# EAGLE design LT3060XTS8_45V_to_1V8 (EAGLE 7.2.0)
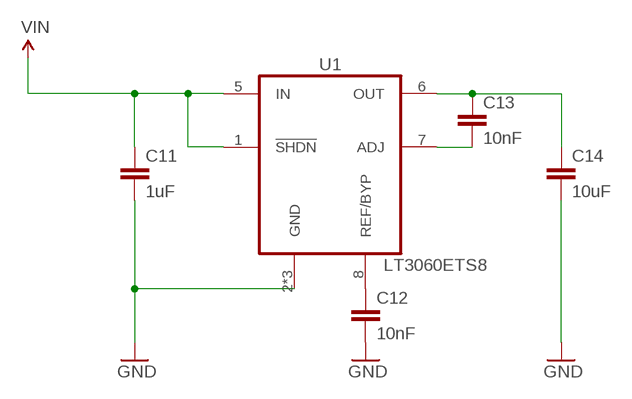
[diagram p0: schematic, sheet 1]

## Parts
C11  1uF  C-EUC0402  [C0402]
C12  10nF  C-EUC0402  [C0402]
C13  10nF  C-EUC0402  [C0402]
C14  10uF  C-EUC0402  [C0402]
U1  LT3060ETS8  [LINEAR_TS8]

## Nets
GND: C11.2 C12.2 C14.2 U1.2(GND) U1.3(GND) U1.4(GND)
N$2: C13.2 U1.7(ADJ)
N$5: C12.1 U1.8(REF/BYP)
OUT: C13.1 C14.1 U1.6(OUT)
VIN: C11.1 U1.1(!SHDN) U1.5(IN)

## Library data of the parts
C11-C14 = rcl:C-EU: CAPACITOR, European symbol
U1 = 1V8:LT3060; TEMP_RANGE: -40 to 125*C

## Board
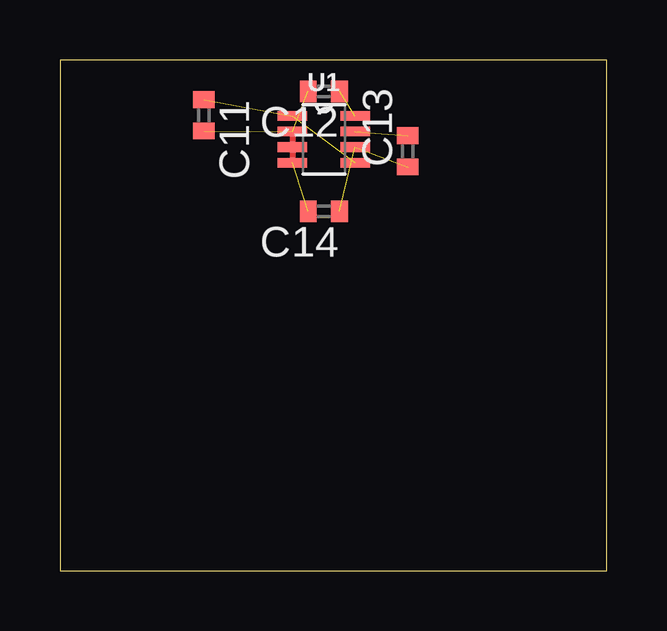
[diagram p1: board, top side]

Size 22.8 x 21.31 mm. Coordinates in mm from the lower left corner, seen from the top.
Outline: 0,0 22.8,0 22.8,21.31 0,21.31 0,0
Copper layers (1*16): Top 0.0356mm / dielectric 1.5011mm / Bottom 0.0356mm
Design rules "oshpark-2layer": minimum track width 6mil, minimum drill 13mil, track to track 6mil, track to pad 6mil, pad to pad 6mil, via to via 6mil, smd to smd 6mil, copper to edge 15mil, drill to drill 6mil, minimum pad ring 7mil, minimum via ring 7mil, stop-mask expansion 4mil, vias tented up to drill 0mil, thermal gap 10mil

### Footprints (pad centres in the part's own frame; a part is rotated, then mirrored left to right if it is on the bottom)
C0402 = smd 0.7 x 0.9: 1 -0.65,0; 2 0.65,0
LINEAR_TS8 = smd 1.22 x 0.4: 1 -1.31,0.975; 2 -1.31,0.325; 3 -1.31,-0.325; 4 -1.31,-0.975; 5 1.31,-0.975; 6 1.31,-0.325; 7 1.31,0.325; 8 1.31,0.975

### Placement (x,y rotation side)
C11  6,19 270 top
C12  11,20 180 top
C13  14.5,17.5 90 top
C14  11,15 180 top
U1  11,18 0 top

### Tracks (layer width: path | path; a pad name or v marks a point on that pad's centre or on a via)
GND  (3 unrouted)
  Top 0.254: U1.2 U1.3 U1.4
N$2  (1 unrouted)
N$5  (1 unrouted)
OUT  (2 unrouted)
VIN  (2 unrouted)